# Altium schematic sheet 06 LAN7800.SchDoc: LAN7800
size 420 x 297 mm; SheetNumber: 5; SheetTotal: 7
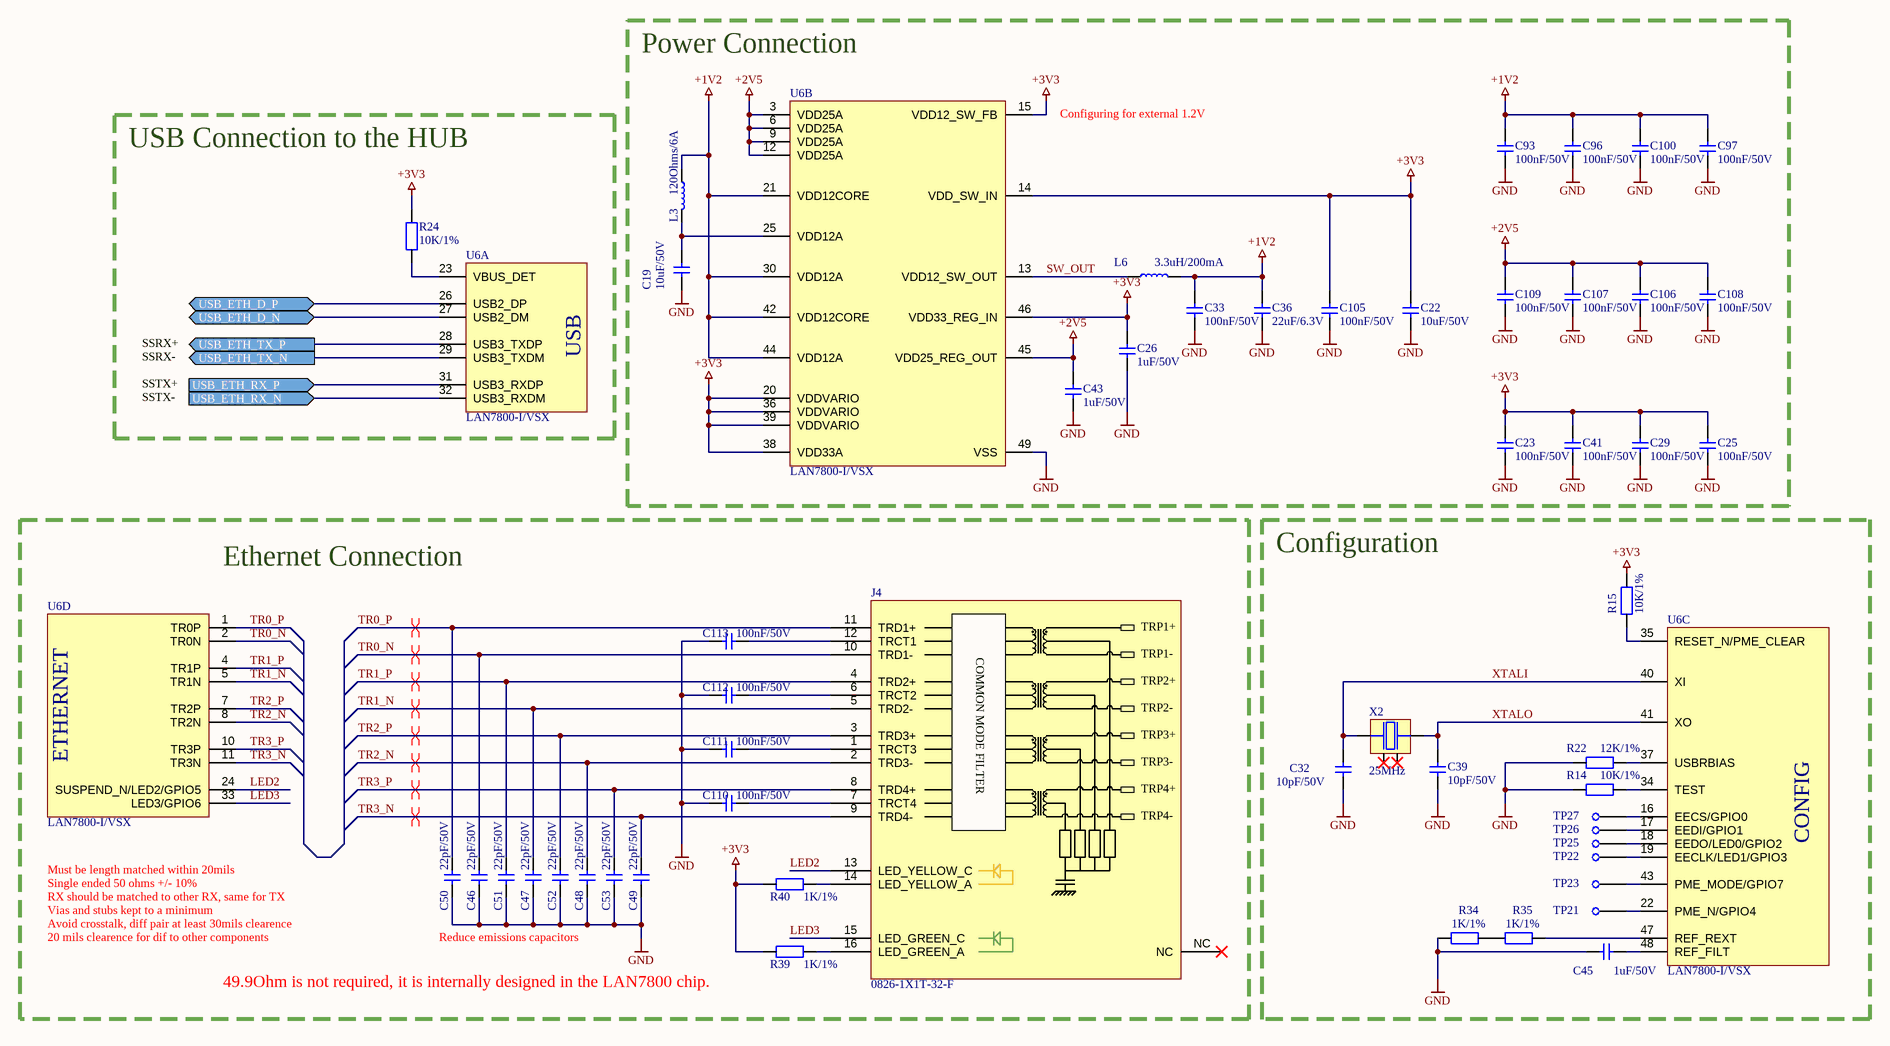
[diagram p0: 06 LAN7800.SchDoc]

## Parts
C19  10uF/50V  [CAPC3216X18N]
C22  10uF/50V  [CAPC3216X18N]
C23  100nF/50V  [CAPC1005X06N]
C25  100nF/50V  [CAPC1005X06N]
C26  1uF/50V  [INDC1608X10N]
C29  100nF/50V  [CAPC1005X06N]
C32  10pF/50V  [CAPC1005X06N]
C33  100nF/50V  [CAPC1005X06N]
C36  22uF/6.3V  [INDC1608X10N]
C39  10pF/50V  [CAPC1005X06N]
C41  100nF/50V  [CAPC1005X06N]
C43  1uF/50V  [INDC1608X10N]
C45  1uF/50V  [INDC1608X10N]
C46  22pF/50V  [CAPC1005X06N]
C47  22pF/50V  [CAPC1005X06N]
C48  22pF/50V  [CAPC1005X06N]
C49  22pF/50V  [CAPC1005X06N]
C50  22pF/50V  [CAPC1005X06N]
C51  22pF/50V  [CAPC1005X06N]
C52  22pF/50V  [CAPC1005X06N]
C53  22pF/50V  [CAPC1005X06N]
C93  100nF/50V  [CAPC1005X06N]
C96  100nF/50V  [CAPC1005X06N]
C97  100nF/50V  [CAPC1005X06N]
C100  100nF/50V  [CAPC1005X06N]
C105  100nF/50V  [CAPC1005X06N]
C106  100nF/50V  [CAPC1005X06N]
C107  100nF/50V  [CAPC1005X06N]
C108  100nF/50V  [CAPC1005X06N]
C109  100nF/50V  [CAPC1005X06N]
C110  100nF/50V  [CAPC1005X06N]
C111  100nF/50V  [CAPC1005X06N]
C112  100nF/50V  [CAPC1005X06N]
C113  100nF/50V  [CAPC1005X06N]
J4  0826-1X1T-32-F  [0826-1X1T-32-F]
L3  120Ohms/6A  [INDC3216X18N]
L6  3.3uH/200mA  [INDP3225X21M]
R14  10K/1%  [RESC1005X04N]
R15  10K/1%  [RESC1005X04N]
R22  12K/1%  [RESC1005X04N]
R24  10K/1%  [RESC1005X04N]
R34  1K/1%  [RESC1005X04N]
R35  1K/1%  [RESC1005X04N]
R39  1K/1%  [RESC1005X04N]
R40  1K/1%  [RESC1005X04N]
TP21  Test Point 1mm  [TEST_POINT_1mm]  (value not drawn)
TP22  Test Point 1mm  [TEST_POINT_1mm]  (value not drawn)
TP23  Test Point 1mm  [TEST_POINT_1mm]  (value not drawn)
TP25  Test Point 1mm  [TEST_POINT_1mm]  (value not drawn)
TP26  Test Point 1mm  [TEST_POINT_1mm]  (value not drawn)
TP27  Test Point 1mm  [TEST_POINT_1mm]  (value not drawn)
U6  LAN7800-I/VSX  [PQFN40P600X600X90_HS-49N]  (parts A,B,C,D of 4)
X2  25MHz  [XRCGB25M000F3M00R0]

## Blocks framed on the sheet
Power Connection: C19 C22 C23 C25 C26 C29 C33 C36 C41 C43 C93 C96 C97 C100 C105-C109 L3 L6 U6
USB Connection to the HUB: R24 U6
Ethernet Connection: C46-C53 C110-C113 J4 R39 R40 U6
Configuration: C32 C39 C45 R14 R15 R22 R34 R35 TP21-TP23 TP25-TP27 U6 X2

## Ports
USB_ETH_D_N (bidir), USB_ETH_D_P (bidir), USB_ETH_RX_N (in), USB_ETH_RX_P (in), USB_ETH_TX_N (out), USB_ETH_TX_P (out)

## Nets
+1V2: C33.1 C36.2 C93.1 C96.1 C97.1 C100.1 L3.1 L6.2 U6.21(VDD12CORE) U6.30(VDD12A) U6.42(VDD12CORE) U6.44(VDD12A)
+2V5: C43.2 C106.1 C107.1 C108.1 C109.1 U6.3(VDD25A) U6.6(VDD25A) U6.9(VDD25A) U6.12(VDD25A) U6.45(VDD25_REG_OUT)
+3V3: C22.2 C23.1 C25.1 C26.2 C29.1 C41.1 C105.1 R15.1 R24.1 R39.2 R40.2 U6.14(VDD_SW_IN) U6.15(VDD12_SW_FB) U6.20(VDDVARIO) U6.36(VDDVARIO) U6.38(VDD33A) U6.39(VDDVARIO) U6.46(VDD33_REG_IN)
GND: C19.1 C22.1 C23.2 C25.2 C26.1 C29.2 C32.1 C33.2 C36.1 C39.1 C41.2 C43.1 C45.2 C46.1 C47.1 C48.1 C49.1 C50.1 C51.1 C52.1 C53.1 C93.2 C96.2 C97.2 C100.2 C105.2 C106.2 C107.2 C108.2 C109.2 C110.2 C111.2 C112.2 C113.2 R14.1 R22.2 R34.1 U6.49(VSS)
LED2: J4.13(LED_YELLOW_C) U6.24(SUSPEND_N/LED2/GPIO5)
LED3: J4.15(LED_GREEN_C) U6.33(LED3/GPIO6)
SW_OUT: L6.1 U6.13(VDD12_SW_OUT)
TR0_N: C46.2 J4.10(TRD1-) U6.2(TR0N)
TR0_P: C50.2 J4.11(TRD1+) U6.1(TR0P)
TR1_N: C47.2 J4.5(TRD2-) U6.5(TR1N)
TR1_P: C51.2 J4.4(TRD2+) U6.4(TR1P)
TR2_N: C48.2 J4.2(TRD3-) U6.8(TR2N)
TR2_P: C52.2 J4.3(TRD3+) U6.7(TR2P)
TR3_N: C49.2 J4.9(TRD4-) U6.11(TR3N)
TR3_P: C53.2 J4.8(TRD4+) U6.10(TR3P)
USB_ETH_D_N: U6.27(USB2_DM) ; port USB_ETH_D_N
USB_ETH_D_P: U6.26(USB2_DP) ; port USB_ETH_D_P
USB_ETH_RX_N: U6.32(USB3_RXDM) ; port USB_ETH_RX_N
USB_ETH_RX_P: U6.31(USB3_RXDP) ; port USB_ETH_RX_P
USB_ETH_TX_N: U6.29(USB3_TXDM) ; port USB_ETH_TX_N
USB_ETH_TX_P: U6.28(USB3_TXDP) ; port USB_ETH_TX_P
XTALI: C32.2 U6.40(XI) X2.3
XTALO: C39.2 U6.41(XO) X2.1
NetC19_2: C19.2 L3.2 U6.25(VDD12A)
NetC45_1: C45.1 U6.48(REF_FILT)
NetC110_1: C110.1 J4.7(TRCT4)
NetC111_1: C111.1 J4.1(TRCT3)
NetC112_1: C112.1 J4.6(TRCT2)
NetC113_1: C113.1 J4.12(TRCT1)
NetJ4_14: J4.14(LED_YELLOW_A) R40.1
NetJ4_16: J4.16(LED_GREEN_A) R39.1
NetR14_2: R14.2 U6.34(TEST)
NetR15_2: R15.2 U6.35(RESET_N/PME_CLEAR)
NetR22_1: R22.1 U6.37(USBRBIAS)
NetR24_2: R24.2 U6.23(VBUS_DET)
NetR34_2: R34.2 R35.1
NetR35_2: R35.2 U6.47(REF_REXT)
NetTP21_1: TP21.1 U6.22(PME_N/GPIO4)
NetTP22_1: TP22.1 U6.19(EECLK/LED1/GPIO3)
NetTP23_1: TP23.1 U6.43(PME_MODE/GPIO7)
NetTP25_1: TP25.1 U6.18(EEDO/LED0/GPIO2)
NetTP26_1: TP26.1 U6.17(EEDI/GPIO1)
NetTP27_1: TP27.1 U6.16(EECS/GPIO0)

Not connected (* = marked no-connect by the designer): J4 NC*; X2 2* 4*

## Layout directives
differential pair; differential pair class ETHERNET: TR0_N, TR0_P, TR1_N, TR1_P, TR2_N, TR2_P, TR3_N, TR3_P

## Notes on the sheet
- Configuring for external 1.2V
- SSRX+
- SSRX-
- SSTX+
- SSTX-
- Must be length matched within 20mils
- Single ended 50 ohms +/- 10%
- RX should be matched to other RX, same for TX
- Vias and stubs kept to a minimum
- Avoid crosstalk, diff pair at least 30mils clearence
- 20 mils clearence for dif to other components
- Reduce emissions capacitors
- (near R39) 49.9Ohm is not required, it is internally designed in the LAN7800 chip.
- Title
- Project
- Size
- Date
- Revision
- A3
- Designed By
- (in symbol 0826-1X1T-32-F) TRP1+; COMMON MODE FILTER; TRP1-; TRP2+; TRP2-; TRP3+; TRP3-; TRP4+; TRP4-
- (in symbol LAN7800-I/VSX, part A) USB
- (in symbol LAN7800-I/VSX, part C) CONFIG
- (in symbol LAN7800-I/VSX, part D) ETHERNET

## Library data of the parts
C19 C22 = GRT31CR61H106ME01L: 10 µF ±20% 50V Ceramic Capacitor X5R 1206 (3216 Metric); manufacturer: Murata Electronics; mfr_part_number: GRT31CR61H106ME01L; assembler_number: GRT31CR61H106ME01L; datasheet: https://search.murata.co.jp/Ceramy/image/img/A01X/G101/ENG/GRT31CR61H106ME01-01.pdf
C23 C25 C29 C33 C41 C93 C96 C97 C100 C105-C113 = GCM155R71H104KE02J: 0.1 µF ±10% 50V Ceramic Capacitor X7R 0402 (1005 Metric); manufacturer: Murata Electronics; mfr_part_number: GCM155R71H104KE02J; assembler_number: GCM155R71H104KE02J; datasheet: https://search.murata.co.jp/Ceramy/image/img/A01X/G101/ENG/GCM155R71H104KE02-01.pdf
C26 C43 C45 = GRT188R61H105KE13D: 1 µF ±10% 50V Ceramic Capacitor X5R 0603 (1608 Metric); manufacturer: Murata Electronics; mfr_part_number: GRT188R61H105KE13D; assembler_number: GRT188R61H105KE13D; datasheet: https://search.murata.co.jp/Ceramy/image/img/A01X/G101/ENG/GRT188R61H105KE13-01.pdf
C32 C39 = GCM1555C1H100JA16D: 10 pF ±5% 50V Ceramic Capacitor C0G, NP0 0402 (1005 Metric); manufacturer: Murata Electronics; mfr_part_number: GCM1555C1H100JA16D; assembler_number: GCM1555C1H100JA16D; datasheet: https://www.murata.com/-/media/webrenewal/support/library/catalog/products/k35e.ashx?la=en-us&cvid=20200508021757000000
C36 = GRT188C80J226ME13D: 22 µF ±20% 6.3V Ceramic Capacitor X6S 0603 (1608 Metric); manufacturer: Murata Electronics; mfr_part_number: GRT188C80J226ME13D; assembler_number: GRT188C80J226ME13D; datasheet: https://search.murata.co.jp/Ceramy/image/img/A01X/G101/ENG/GRT188C80J226ME13-01.pdf
C46-C53 = CL05C220JB51PNC: 22 pF ±5% 50V Ceramic Capacitor C0G, NP0 0402 (1005 Metric); manufacturer: Samsung Electro-Mechanics; mfr_part_number: CL05C220JB51PNC; assembler_number: CL05C220JB51PNC; datasheet: https://media.digikey.com/pdf/Data%20Sheets/Samsung%20PDFs/CL05C220JB51PNC_Spec.pdf
J4 = 0826-1X1T-32-F: 1 Port RJ45Through Hole 10/100/1000 Base-T, AutoMDIX; manufacturer: Bel Fuse Inc.; mfr_part_number: 0826-1X1T-32-F; assembler_number: 0826-1X1T-32-F; datasheet: https://www.belfuse.com/resources/drawings/magneticsolutions/dr-mag-0826-1x1t-32-f.pdf
L3 = BLM31KN121SN1L: 120 Ohms @ 100 MHz 1 Power Line Ferrite Bead 1206 (3216 Metric) 6A 9mOhm; manufacturer: Murata Electronics; mfr_part_number: BLM31KN121SN1L; assembler_number: BLM31KN121SN1L; datasheet: https://www.murata.com/en-us/products/productdata/8801529331742/ENFA0091.pdf
L6 = B82422A1332J100: 3.3 µH Unshielded Drum Core, Wirewound Inductor 200 mA 1.2Ohm Max 2-SMD, J-Lead; manufacturer: EPCOS - TDK Electronics; mfr_part_number: B82422A1332J100; assembler_number: B82422A1332J100; datasheet: https://www.tdk-electronics.tdk.com/inf/30/db/ind_2008/b82422a_100.pdf
R14 R15 R24 = RMCF0402FT10K0: 10 kOhms ±1% 0.063W, 1/16W Chip Resistor 0402 (1005 Metric) Automotive AEC-Q200 Thick Film; manufacturer: Stackpole Electronics Inc; mfr_part_number: RMCF0402FT10K0; assembler_number: RMCF0402FT10K0; datasheet: https://www.seielect.com/Catalog/SEI-RMCF_RMCP.pdf
R22 = ERJ-2RKF1202X: 12 kOhms ±1% 0.1W, 1/10W Chip Resistor 0402 (1005 Metric) Automotive AEC-Q200 Thick Film; manufacturer: Panasonic Electronic Components; mfr_part_number: ERJ-2RKF1202X; assembler_number: ERJ-2RKF1202X; datasheet: https://industrial.panasonic.com/cdbs/www-data/pdf/RDA0000/AOA0000C304.pdf
R34 R35 R39 R40 = RMCF0402FT1K00: 1 kOhms ±1% 0.063W, 1/16W Chip Resistor 0402 (1005 Metric) Automotive AEC-Q200 Thick Film; manufacturer: Stackpole Electronics Inc; mfr_part_number: RMCF0402FT1K00; assembler_number: RMCF0402FT1K00; datasheet: https://www.seielect.com/Catalog/SEI-RMCF_RMCP.pdf
TP21-TP23 TP25-TP27 = TestPoint
U6 = LAN7800-I/VSX: Ethernet Controller 10/100/1000 Base-TX PHY Interface 48-SQFN (6x6); manufacturer: Microchip Technology; mfr_part_number: LAN7800-I/VSX; assembler_number: LAN7800-I/VSX; datasheet: https://ww1.microchip.com/downloads/en/DeviceDoc/LAN7800-Data-Sheet-DS00001992G.pdf
X2 = XRCGB25M000F3M00R0: 25 MHz ±30ppm Crystal 6pF 150 Ohms 4-SMD, No Lead; manufacturer: Murata Electronics; mfr_part_number: XRCGB25M000F3M00R0; assembler_number: XRCGB25M000F3M00R0; datasheet: https://www.murata.com/~/media/webrenewal/campaign/ads/america/timing/p79e.ashx?la=en-us